# Altium project Prj_3pha40V.PrjPcb
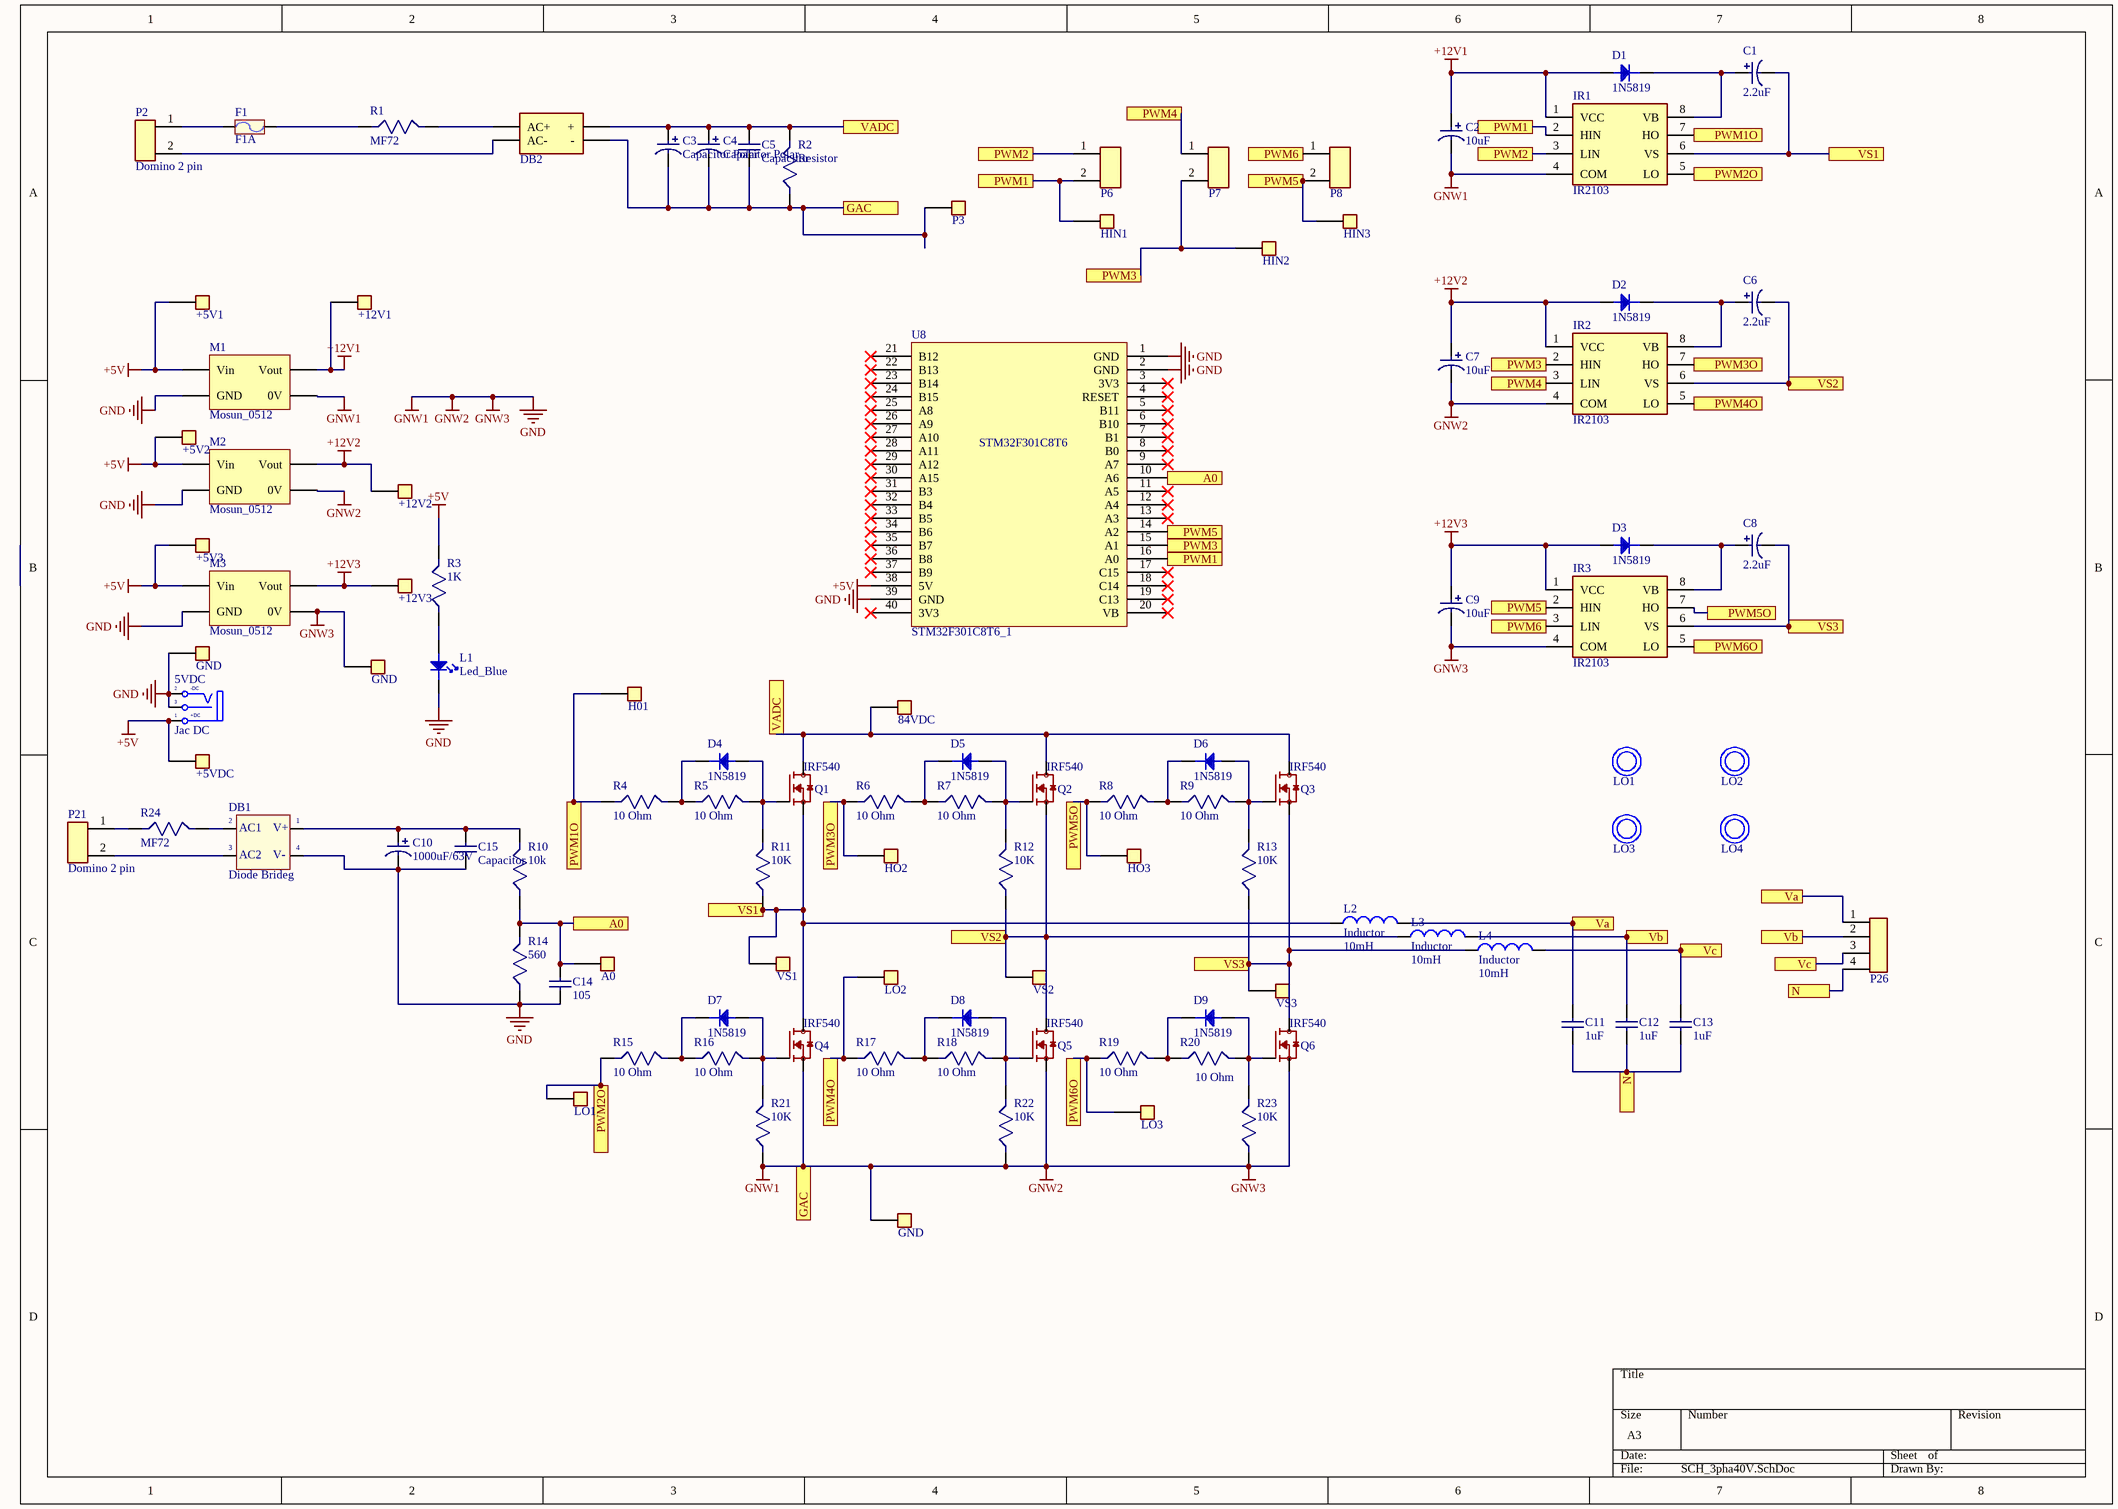
[diagram p0: SCH_3pha40V.SchDoc]
1 sheet, 104 parts. Net scope: flat (ports and power ports of the same name join across sheets).
Board files: PCB_3pha40V_V2.PcbDoc, PCB_3PHA40V_V3.PcbDoc

## Sheet SCH_3pha40V.SchDoc
size A3

### Parts
(Parts that share a designator on the sheet are numbered #1, #2 ... from top to bottom, then left to right.)
5VDC  Jac DC  [DC-IN]
84VDC  testpin  [tp_white_1p]  (value not drawn)
+5V1  testpin  [Tp_blue_1p]  (value not drawn)
+5V2  testpin  [Tp_blue_1p]  (value not drawn)
+5V3  testpin  [Tp_blue_1p]  (value not drawn)
+5VDC  testpin  [Tp_black_1p]  (value not drawn)
+12V1  testpin  [tp_red_1p]  (value not drawn)
+12V2  testpin  [tp_red_1p]  (value not drawn)
+12V3  testpin  [tp_red_1p]  (value not drawn)
A0  testpin  [tp_yellow_1p]  (value not drawn)
C1  2.2uF  [CP1/2]
C2  10uF  [CP1/2]
C3  Capacitor Polar  [capacitor_polar_25mmx40mm]
C4  Capacitor Polar  [capacitor_polar_25mmx40mm]
C5  Capacitor  [Capacitor P15]
C6  2.2uF  [CP1/2]
C7  10uF  [CP1/2]
C8  2.2uF  [CP1/2]
C9  10uF  [CP1/2]
C10  1000uF/63V  [CP3/7]
C11  1uF  [CF22.5]
C12  1uF  [CF22.5]
C13  1uF  [CF22.5]
C14  105  [CN1]
C15  Capacitor  [Capacitor P15]
D1  1N5819  [diode_dip]
D2  1N5819  [diode_dip]
D3  1N5819  [diode_dip]
D4  1N5819  [diode_dip]
D5  1N5819  [diode_dip]
D6  1N5819  [diode_dip]
D7  1N5819  [diode_dip]
D8  1N5819  [diode_dip]
D9  1N5819  [diode_dip]
DB1  Diode Brideg  [CAU 1AC]
DB2  Diode bridge  [KBL]  (value not drawn)
F1  F1A  [FUSE]
GND#1  testpin  [Tp_black_1p]  (value not drawn)
GND#2  testpin  [Tp_black_1p]  (value not drawn)
GND#3  testpin  [tp_white_1p]  (value not drawn)
H01  testpin  [tp_yellow_1p]  (value not drawn)
HIN1  testpin  [tp_yellow_1p]  (value not drawn)
HIN2  testpin  [tp_yellow_1p]  (value not drawn)
HIN3  testpin  [tp_yellow_1p]  (value not drawn)
HO2  testpin  [tp_yellow_1p]  (value not drawn)
HO3  testpin  [tp_yellow_1p]  (value not drawn)
IR1  IR2103  [DIP-8_2.54_8_t/h]
IR2  IR2103  [DIP-8_2.54_8_t/h]
IR3  IR2103  [DIP-8_2.54_8_t/h]
L1  Led_Blue  [led_blue_t/h_5mm]
L2  Inductor  value 10mH  [IND_SINE]
L3  Inductor  value 10mH  [IND_SINE]
L4  Inductor  value 10mH  [IND_SINE]
LO1#1  LO KHOAN  [Lo Khoang]  (value not drawn)
LO1#2  testpin  [tp_yellow_1p]  (value not drawn)
LO2#1  LO KHOAN  [Lo Khoang]  (value not drawn)
LO2#2  testpin  [tp_yellow_1p]  (value not drawn)
LO3#1  LO KHOAN  [Lo Khoang]  (value not drawn)
LO3#2  testpin  [tp_yellow_1p]  (value not drawn)
LO4  LO KHOAN  [Lo Khoang]  (value not drawn)
M1  Mosun_0512  [Mosun_050x]
M2  Mosun_0512  [Mosun_050x]
M3  Mosun_0512  [Mosun_050x]
P2  Domino 2 pin  [HED2A]
P3  testpin  [tp_white_1p]  (value not drawn)
P6  header_2x1  [head2]  (value not drawn)
P7  header_2x1  [head2]  (value not drawn)
P8  header_2x1  [head2]  (value not drawn)
P21  Domino 2 pin  [HED2A]
P26  Terminal_4p  [Terminal 4pin]  (value not drawn)
Q1  IRF540  [TO-220]
Q2  IRF540  [TO-220]
Q3  IRF540  [TO-220]
Q4  IRF540  [TO-220]
Q5  IRF540  [TO-220]
Q6  IRF540  [TO-220]
R1  MF72  [MF72]
R2  Resistor  [res_1wat]
R3  1K  [resistor_t/h_1/4w]
R4  10 Ohm  [res_1wat]
R5  10 Ohm  [res_1wat]
R6  10 Ohm  [res_1wat]
R7  10 Ohm  [res_1wat]
R8  10 Ohm  [res_1wat]
R9  10 Ohm  [res_1wat]
R10  10k  [resistor_t/h_1/4w]
R11  10K  [resistor_t/h_1/4w]
R12  10K  [resistor_t/h_1/4w]
R13  10K  [resistor_t/h_1/4w]
R14  560  [resistor_t/h_1/4w]
R15  10 Ohm  [res_1wat]
R16  10 Ohm  [res_1wat]
R17  10 Ohm  [res_1wat]
R18  10 Ohm  [res_1wat]
R19  10 Ohm  [res_1wat]
R20  10 Ohm  [res_1wat]
R21  10K  [resistor_t/h_1/4w]
R22  10K  [resistor_t/h_1/4w]
R23  10K  [resistor_t/h_1/4w]
R24  MF72  [MF72 D9]
U8  STM32F301C8T6_1  [STM32F103C8T6_trantanloc]
VS1  testpin  [tp_white_1p]  (value not drawn)
VS2  testpin  [tp_white_1p]  (value not drawn)
VS3  testpin  [tp_white_1p]  (value not drawn)

### Ports
A0, GAC, N, PWM1, PWM1O, PWM2, PWM2O, PWM3, PWM3O, PWM4, PWM4O, PWM5, PWM5O, PWM6, PWM6O, Va, VADC, Vb, Vc, VS1, VS2, VS3

### Nets
+5V: 5VDC.1(T) +5V1.1 +5V2.1 +5V3.1 +5VDC.1 M1.2(Vin) M2.2(Vin) M3.2(Vin) R3.2 U8.38(5V)
+12V1: +12V1.1 C2.1 D1.1(A) IR1.1(VCC) M1.4(Vout)
+12V2: +12V2.1 C7.1 D2.1(A) IR2.1(VCC) M2.4(Vout)
+12V3: +12V3.1 C9.1 D3.1(A) IR3.1(VCC) M3.4(Vout)
GND: 5VDC.2(TN) 5VDC.3(S) C2.2 C3.2 C4.2 C5.2 C7.2 C9.2 C10.2 C14.2 C15.2 DB1.4(-V_OUT) DB2.3(-) GND#1.1 GND#2.1 GND#3.1 IR1.4(COM) IR2.4(COM) IR3.4(COM) L1.2(K) M1.1(GND) M1.3(0V) M2.1(GND) M2.3(0V) M3.1(GND) M3.3(0V) P3.1 Q4.3(S) Q5.3(S) Q6.3(S) R2.1 R14.1 R21.1 R22.1 R23.1 U8.1(GND) U8.2(GND) U8.39(GND) ; port GAC  [also labelled GNW1, GNW2, GNW3]
Net84VDC_1: 84VDC.1 C3.1 C4.1 C5.1 DB2.0(+) Q1.2(D) Q2.2(D) Q3.2(D) R2.2 ; port VADC
NetA0_1: A0.1 C14.1 R10.1 R14.2 U8.10(A6) ; port A0
NetC1_1: C1.1 D1.2(K) IR1.8(VB)
NetC1_2: C1.2 IR1.6(VS) L2.1 Q1.3(S) Q4.2(D) R11.1 VS1.1 ; port VS1
NetC6_1: C6.1 D2.2(K) IR2.8(VB)
NetC6_2: C6.2 IR2.6(VS) L3.1 Q2.3(S) Q5.2(D) R12.1 VS2.1 ; port VS2
NetC8_1: C8.1 D3.2(K) IR3.8(VB)
NetC8_2: C8.2 IR3.6(VS) L4.1 Q3.3(S) Q6.2(D) R13.1 VS3.1 ; port VS3
NetC10_1: C10.1 C15.1 DB1.1(+V_OUT) R10.2
NetC11_1: C11.1 L2.2 P26.1 ; port Va
NetC11_2: C11.2 C12.2 C13.2 P26.4 ; port N
NetC12_1: C12.1 L3.2 P26.2 ; port Vb
NetC13_1: C13.1 L4.2 P26.3 ; port Vc
NetD4_1: D4.1(A) Q1.1(G) R5.2 R11.2
NetD4_2: D4.2(K) R4.2 R5.1
NetD5_1: D5.1(A) Q2.1(G) R7.2 R12.2
NetD5_2: D5.2(K) R6.2 R7.1
NetD6_1: D6.1(A) Q3.1(G) R9.2 R13.2
NetD6_2: D6.2(K) R8.2 R9.1
NetD7_1: D7.1(A) Q4.1(G) R16.2 R21.2
NetD7_2: D7.2(K) R15.2 R16.1
NetD8_1: D8.1(A) Q5.1(G) R18.2 R22.2
NetD8_2: D8.2(K) R17.2 R18.1
NetD9_1: D9.1(A) Q6.1(G) R20.2 R23.2
NetD9_2: D9.2(K) R19.2 R20.1
NetDB1_2: DB1.2(AC1) R24.2
NetDB1_3: DB1.3(AC2) P21.2
NetDB2_1: DB2.1(AC+) R1.2
NetDB2_2: DB2.2(AC-) P2.2
NetF1_1: F1.1 P2.1
NetF1_2: F1.2 R1.1
NetH01_1: H01.1 IR1.7(HO) R4.1 ; port PWM1O
NetHIN1_1: HIN1.1 IR1.2(HIN) P6.2 U8.16(A0) ; port PWM1
NetHIN2_1: HIN2.1 IR2.2(HIN) P7.2 U8.15(A1) ; port PWM3
NetHIN3_1: HIN3.1 IR3.2(HIN) P8.2 U8.14(A2) ; port PWM5
NetHO2_1: HO2.1 IR2.7(HO) R6.1 ; port PWM3O
NetHO3_1: HO3.1 IR3.7(HO) R8.1 ; port PWM5O
NetIR1_3: IR1.3(LIN) P6.1 ; port PWM2
NetIR1_5: IR1.5(LO) LO1#2.1 R15.1 ; port PWM2O
NetIR2_3: IR2.3(LIN) P7.1 ; port PWM4
NetIR2_5: IR2.5(LO) LO2#2.1 R17.1 ; port PWM4O
NetIR3_3: IR3.3(LIN) P8.1 ; port PWM6
NetIR3_5: IR3.5(LO) LO3#2.1 R19.1 ; port PWM6O
NetL1_1: L1.1(A) R3.1
NetP21_1: P21.1 R24.1

Not connected (* = marked no-connect by the designer): U8 3(3V3)* 4(RESET)* 5(B11)* 6(B10)* 7(B1)* 8(B0)* 9(A7)* 11(A5)* 12(A4)* 13(A3)* 17(C15)* 18(C14)* 19(C13)* 20(VB)* 21(B12)* 22(B13)* 23(B14)* 24(B15)* 25(A8)* 26(A9)* 27(A10)* 28(A11)* 29(A12)* 30(A15)* 31(B3)* 32(B4)* 33(B5)* 34(B6)* 35(B7)* 36(B8)* 37(B9)* 40(3V3)*

### Notes on the sheet
- (in symbol DB) V+; V-
- (in symbol DCIN) -DC; +DC
- (in symbol STM32F301C8T6_1) STM32F301C8T6

### Library data of the parts
5VDC = DCIN: Jac DC input; Value: Jac DC
C1 C2 C6-C10 = capacitor_polar 6.3x11mm: capacitor polar
C3 C4 = capacitor_polar 6.3x11mm
C5 C11-C15 = capacitor_non_polar: capacitor non polar
D1-D9 = diode
DB1 = DB: Convert AC to DC voltage, 4 pin; Value: Cau 1A
F1 = Fuse: Designed by: VanDungEvn; Value: Fuse
IR1-IR3 = FAN7842
L2-L4 = Inductor: Code_IEC: 1005; Published: 8-Jun-2000; LatestRevisionDate: 29-May-2009; LatestRevisionNote: IPC-7351 Footprint Added.; PackageReference: 0402-A; Publisher: Altium Limited; PackageDescription: Chip Inductor; Code_JEITA: 0402
M1-M3 = Mosun_0x0x
P2 P21 = domino_2pin
Q1-Q6 = Mosfet
R1 R3-R24 = resistor